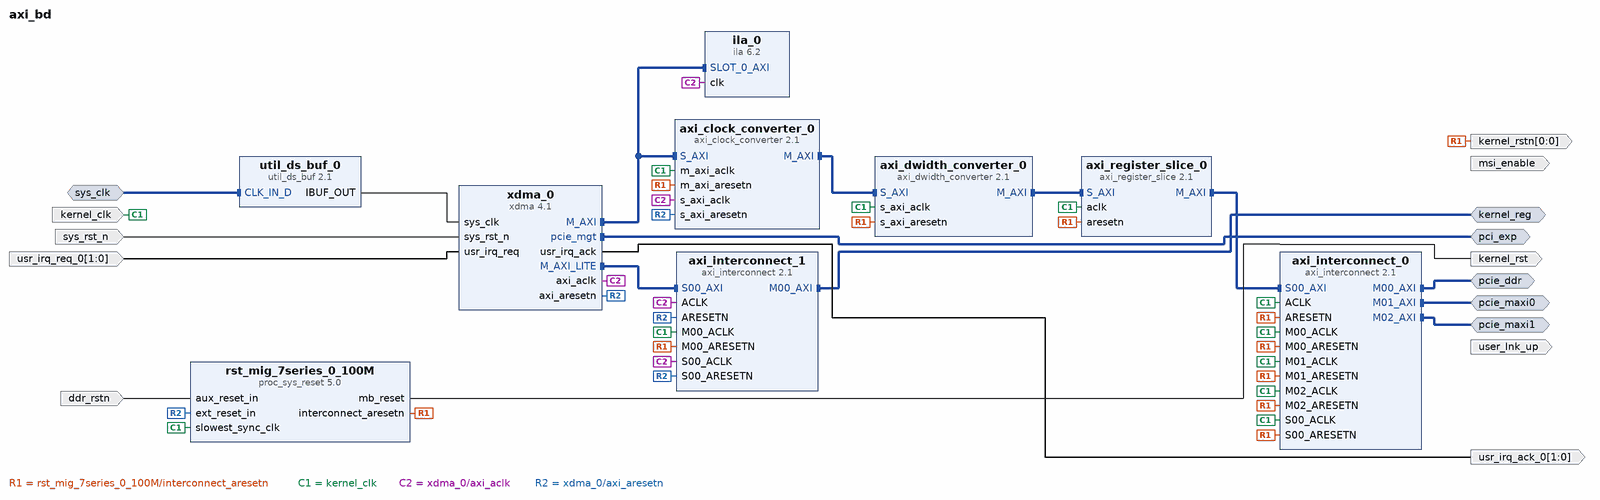
[diagram p0: block diagram of the top level]
# Vivado block design axi_bd, xc7k325tffg900-2, Vivado 2018.3
create_bd_design axi_bd

create_bd_intf_port -mode Master -vlnv xilinx.com:interface:aximm_rtl:1.0 kernel_reg
set_property -dict [list \
  CONFIG.ADDR_WIDTH 32 \
  CONFIG.DATA_WIDTH 32 \
  CONFIG.FREQ_HZ 200000000 \
  CONFIG.HAS_BURST 0 \
  CONFIG.HAS_CACHE 0 \
  CONFIG.HAS_LOCK 0 \
  CONFIG.HAS_QOS 0 \
  CONFIG.HAS_REGION 0 \
  CONFIG.PROTOCOL AXI4LITE \
] [get_bd_intf_ports kernel_reg]
create_bd_intf_port -mode Master -vlnv xilinx.com:interface:pcie_7x_mgt_rtl:1.0 pci_exp
create_bd_intf_port -mode Master -vlnv xilinx.com:interface:aximm_rtl:1.0 pcie_ddr
set_property -dict [list \
  CONFIG.ADDR_WIDTH 32 \
  CONFIG.DATA_WIDTH 512 \
  CONFIG.FREQ_HZ 200000000 \
  CONFIG.HAS_BURST 1 \
  CONFIG.HAS_QOS 1 \
  CONFIG.HAS_REGION 0 \
  CONFIG.NUM_READ_OUTSTANDING 32 \
  CONFIG.NUM_WRITE_OUTSTANDING 16 \
  CONFIG.PROTOCOL AXI4 \
] [get_bd_intf_ports pcie_ddr]
create_bd_intf_port -mode Master -vlnv xilinx.com:interface:aximm_rtl:1.0 pcie_maxi0
set_property -dict [list \
  CONFIG.ADDR_WIDTH 32 \
  CONFIG.DATA_WIDTH 32 \
  CONFIG.FREQ_HZ 200000000 \
  CONFIG.HAS_BURST 1 \
  CONFIG.HAS_CACHE 1 \
  CONFIG.HAS_LOCK 1 \
  CONFIG.HAS_PROT 1 \
  CONFIG.HAS_QOS 1 \
  CONFIG.HAS_REGION 0 \
  CONFIG.NUM_READ_OUTSTANDING 32 \
  CONFIG.NUM_WRITE_OUTSTANDING 16 \
  CONFIG.PROTOCOL AXI4 \
] [get_bd_intf_ports pcie_maxi0]
create_bd_intf_port -mode Master -vlnv xilinx.com:interface:aximm_rtl:1.0 pcie_maxi1
set_property -dict [list \
  CONFIG.ADDR_WIDTH 32 \
  CONFIG.DATA_WIDTH 512 \
  CONFIG.FREQ_HZ 200000000 \
  CONFIG.HAS_BURST 1 \
  CONFIG.PROTOCOL AXI4 \
] [get_bd_intf_ports pcie_maxi1]
create_bd_intf_port -mode Slave -vlnv xilinx.com:interface:diff_clock_rtl:1.0 sys_clk
create_bd_port -dir I -type rst ddr_rstn
create_bd_port -dir I -type clk kernel_clk
set_property -dict [list \
  CONFIG.ASSOCIATED_BUSIF pcie_ddr:pcie_maxi0:pcie_maxi1:kernel_reg \
  CONFIG.ASSOCIATED_RESET ddr_rstn \
  CONFIG.FREQ_HZ 200000000 \
] [get_bd_ports kernel_clk]
create_bd_port -dir O -type rst kernel_rst
create_bd_port -dir O -from 0 -to 0 -type rst kernel_rstn
create_bd_port -dir O msi_enable
create_bd_port -dir I -type rst sys_rst_n
set_property -dict {CONFIG.POLARITY ACTIVE_LOW} [get_bd_ports sys_rst_n]
create_bd_port -dir O user_lnk_up
create_bd_port -dir O -from 1 -to 0 usr_irq_ack_0
create_bd_port -dir I -from 1 -to 0 usr_irq_req_0

create_bd_cell -type ip -vlnv xilinx.com:ip:axi_clock_converter:2.1 axi_clock_converter_0
create_bd_cell -type ip -vlnv xilinx.com:ip:axi_dwidth_converter:2.1 axi_dwidth_converter_0
create_bd_cell -type ip -vlnv xilinx.com:ip:axi_interconnect:2.1 axi_interconnect_1
set_property -dict {CONFIG.NUM_MI 1} [get_bd_cells axi_interconnect_1]
create_bd_cell -type ip -vlnv xilinx.com:ip:ila:6.2 ila_0
create_bd_cell -type ip -vlnv xilinx.com:ip:proc_sys_reset:5.0 rst_mig_7series_0_100M
create_bd_cell -type ip -vlnv xilinx.com:ip:util_ds_buf:2.1 util_ds_buf_0
set_property -dict {CONFIG.C_BUF_TYPE IBUFDSGTE CONFIG.C_SIZE 1} [get_bd_cells util_ds_buf_0]
create_bd_cell -type ip -vlnv xilinx.com:ip:xdma:4.1 xdma_0
set_property -dict [list \
  CONFIG.PF0_DEVICE_ID_mqdma 9028 \
  CONFIG.PF2_DEVICE_ID_mqdma 9028 \
  CONFIG.PF3_DEVICE_ID_mqdma 9028 \
  CONFIG.axi_data_width 128_bit \
  CONFIG.axilite_master_en true \
  CONFIG.axilite_master_size 16 \
  CONFIG.axisten_freq 250 \
  CONFIG.cfg_mgmt_if false \
  CONFIG.mode_selection Advanced \
  CONFIG.pcie_id_if false \
  CONFIG.pciebar2axibar_axil_master 0x0000000000000000 \
  CONFIG.pf0_class_code_base 05 \
  CONFIG.pf0_class_code_interface 00 \
  CONFIG.pf0_class_code_sub 08 \
  CONFIG.pf0_device_id 7028 \
  CONFIG.pf0_sub_class_interface_menu Generic_XT_compatible_serial_controller \
  CONFIG.pf1_bar0_scale Kilobytes \
  CONFIG.pf1_bar0_size 128 \
  CONFIG.pf1_bar1_enabled false \
  CONFIG.pl_link_cap_max_link_speed 5.0_GT/s \
  CONFIG.pl_link_cap_max_link_width X8 \
  CONFIG.plltype QPLL1 \
  CONFIG.xdma_num_usr_irq 2 \
  CONFIG.xdma_rnum_chnl 2 \
  CONFIG.xdma_wnum_chnl 2 \
  CONFIG.xdma_wnum_rids 8 \
] [get_bd_cells xdma_0]
create_bd_cell -type ip -vlnv xilinx.com:ip:axi_interconnect:2.1 axi_interconnect_0
set_property -dict [list \
  CONFIG.M00_HAS_REGSLICE 4 \
  CONFIG.M01_HAS_REGSLICE 4 \
  CONFIG.M02_HAS_DATA_FIFO 0 \
  CONFIG.M02_HAS_REGSLICE 4 \
  CONFIG.NUM_MI 3 \
  CONFIG.S00_HAS_DATA_FIFO 2 \
  CONFIG.S00_HAS_REGSLICE 4 \
] [get_bd_cells axi_interconnect_0]
create_bd_cell -type ip -vlnv xilinx.com:ip:axi_register_slice:2.1 axi_register_slice_0
set_property -dict [list \
  CONFIG.REG_AR 10 \
  CONFIG.REG_AW 10 \
  CONFIG.REG_B 10 \
  CONFIG.REG_R 10 \
  CONFIG.REG_W 10 \
] [get_bd_cells axi_register_slice_0]

# ---- connections ----

connect_bd_intf_net [get_bd_intf_pins axi_clock_converter_0/S_AXI] [get_bd_intf_pins xdma_0/M_AXI]
connect_bd_intf_net [get_bd_intf_pins axi_clock_converter_0/S_AXI] [get_bd_intf_pins ila_0/SLOT_0_AXI]
connect_bd_intf_net [get_bd_intf_pins axi_register_slice_0/S_AXI] [get_bd_intf_pins axi_dwidth_converter_0/M_AXI]
connect_bd_intf_net [get_bd_intf_pins axi_clock_converter_0/M_AXI] [get_bd_intf_pins axi_dwidth_converter_0/S_AXI]
connect_bd_intf_net [get_bd_intf_ports pcie_maxi1] [get_bd_intf_pins axi_interconnect_0/M02_AXI]
connect_bd_intf_net [get_bd_intf_ports sys_clk] [get_bd_intf_pins util_ds_buf_0/CLK_IN_D]
connect_bd_intf_net [get_bd_intf_pins axi_interconnect_1/S00_AXI] [get_bd_intf_pins xdma_0/M_AXI_LITE]
connect_bd_intf_net [get_bd_intf_ports kernel_reg] [get_bd_intf_pins axi_interconnect_1/M00_AXI]
connect_bd_intf_net [get_bd_intf_ports pcie_ddr] [get_bd_intf_pins axi_interconnect_0/M00_AXI]
connect_bd_intf_net [get_bd_intf_ports pci_exp] [get_bd_intf_pins xdma_0/pcie_mgt]
connect_bd_intf_net [get_bd_intf_pins axi_register_slice_0/M_AXI] [get_bd_intf_pins axi_interconnect_0/S00_AXI]
connect_bd_intf_net [get_bd_intf_ports pcie_maxi0] [get_bd_intf_pins axi_interconnect_0/M01_AXI]
connect_bd_net -net M00_ARESETN_1 [get_bd_pins rst_mig_7series_0_100M/interconnect_aresetn] \
  [get_bd_ports kernel_rstn] [get_bd_pins axi_clock_converter_0/m_axi_aresetn] \
  [get_bd_pins axi_dwidth_converter_0/s_axi_aresetn] [get_bd_pins axi_interconnect_1/M00_ARESETN] \
  [get_bd_pins axi_interconnect_0/ARESETN] [get_bd_pins axi_interconnect_0/S00_ARESETN] \
  [get_bd_pins axi_interconnect_0/M02_ARESETN] [get_bd_pins axi_interconnect_0/M01_ARESETN] \
  [get_bd_pins axi_interconnect_0/M00_ARESETN] [get_bd_pins axi_register_slice_0/aresetn]
connect_bd_net [get_bd_ports kernel_clk] \
  [get_bd_pins axi_clock_converter_0/m_axi_aclk] [get_bd_pins axi_dwidth_converter_0/s_axi_aclk] \
  [get_bd_pins axi_interconnect_1/M00_ACLK] [get_bd_pins rst_mig_7series_0_100M/slowest_sync_clk] \
  [get_bd_pins axi_interconnect_0/ACLK] [get_bd_pins axi_interconnect_0/S00_ACLK] [get_bd_pins axi_interconnect_0/M02_ACLK] \
  [get_bd_pins axi_interconnect_0/M01_ACLK] [get_bd_pins axi_interconnect_0/M00_ACLK] [get_bd_pins axi_register_slice_0/aclk]
connect_bd_net [get_bd_ports ddr_rstn] [get_bd_pins rst_mig_7series_0_100M/aux_reset_in]
connect_bd_net [get_bd_pins rst_mig_7series_0_100M/mb_reset] [get_bd_ports kernel_rst]
connect_bd_net [get_bd_ports sys_rst_n] [get_bd_pins xdma_0/sys_rst_n]
connect_bd_net -net usr_irq_req_0_1 [get_bd_ports usr_irq_req_0] [get_bd_pins xdma_0/usr_irq_req]
connect_bd_net [get_bd_pins util_ds_buf_0/IBUF_OUT] [get_bd_pins xdma_0/sys_clk]
connect_bd_net [get_bd_pins xdma_0/axi_aclk] \
  [get_bd_pins axi_clock_converter_0/s_axi_aclk] [get_bd_pins axi_interconnect_1/ACLK] \
  [get_bd_pins axi_interconnect_1/S00_ACLK] [get_bd_pins ila_0/clk]
connect_bd_net [get_bd_pins xdma_0/axi_aresetn] \
  [get_bd_pins axi_clock_converter_0/s_axi_aresetn] [get_bd_pins axi_interconnect_1/ARESETN] \
  [get_bd_pins axi_interconnect_1/S00_ARESETN] [get_bd_pins rst_mig_7series_0_100M/ext_reset_in]
connect_bd_net [get_bd_pins xdma_0/usr_irq_ack] [get_bd_ports usr_irq_ack_0]

# ---- address map ----
assign_bd_address -offset 0x0000000000000000 -range 2G -target_address_space [get_bd_addr_spaces xdma_0/M_AXI] [get_bd_addr_segs pcie_ddr/Reg]
assign_bd_address -offset 0x0000000080000000 -range 16M -target_address_space [get_bd_addr_spaces xdma_0/M_AXI] [get_bd_addr_segs pcie_maxi0/Reg]
assign_bd_address -offset 0x0000000081000000 -range 16M -target_address_space [get_bd_addr_spaces xdma_0/M_AXI] [get_bd_addr_segs pcie_maxi1/Reg]
assign_bd_address -offset 0x00100000 -range 64K -target_address_space [get_bd_addr_spaces xdma_0/M_AXI_LITE] [get_bd_addr_segs kernel_reg/Reg]

validate_bd_design
save_bd_design
